# EAGLE schematic Schematic V1 (EAGLE 9.6.2)

## Sheet 1 of 2
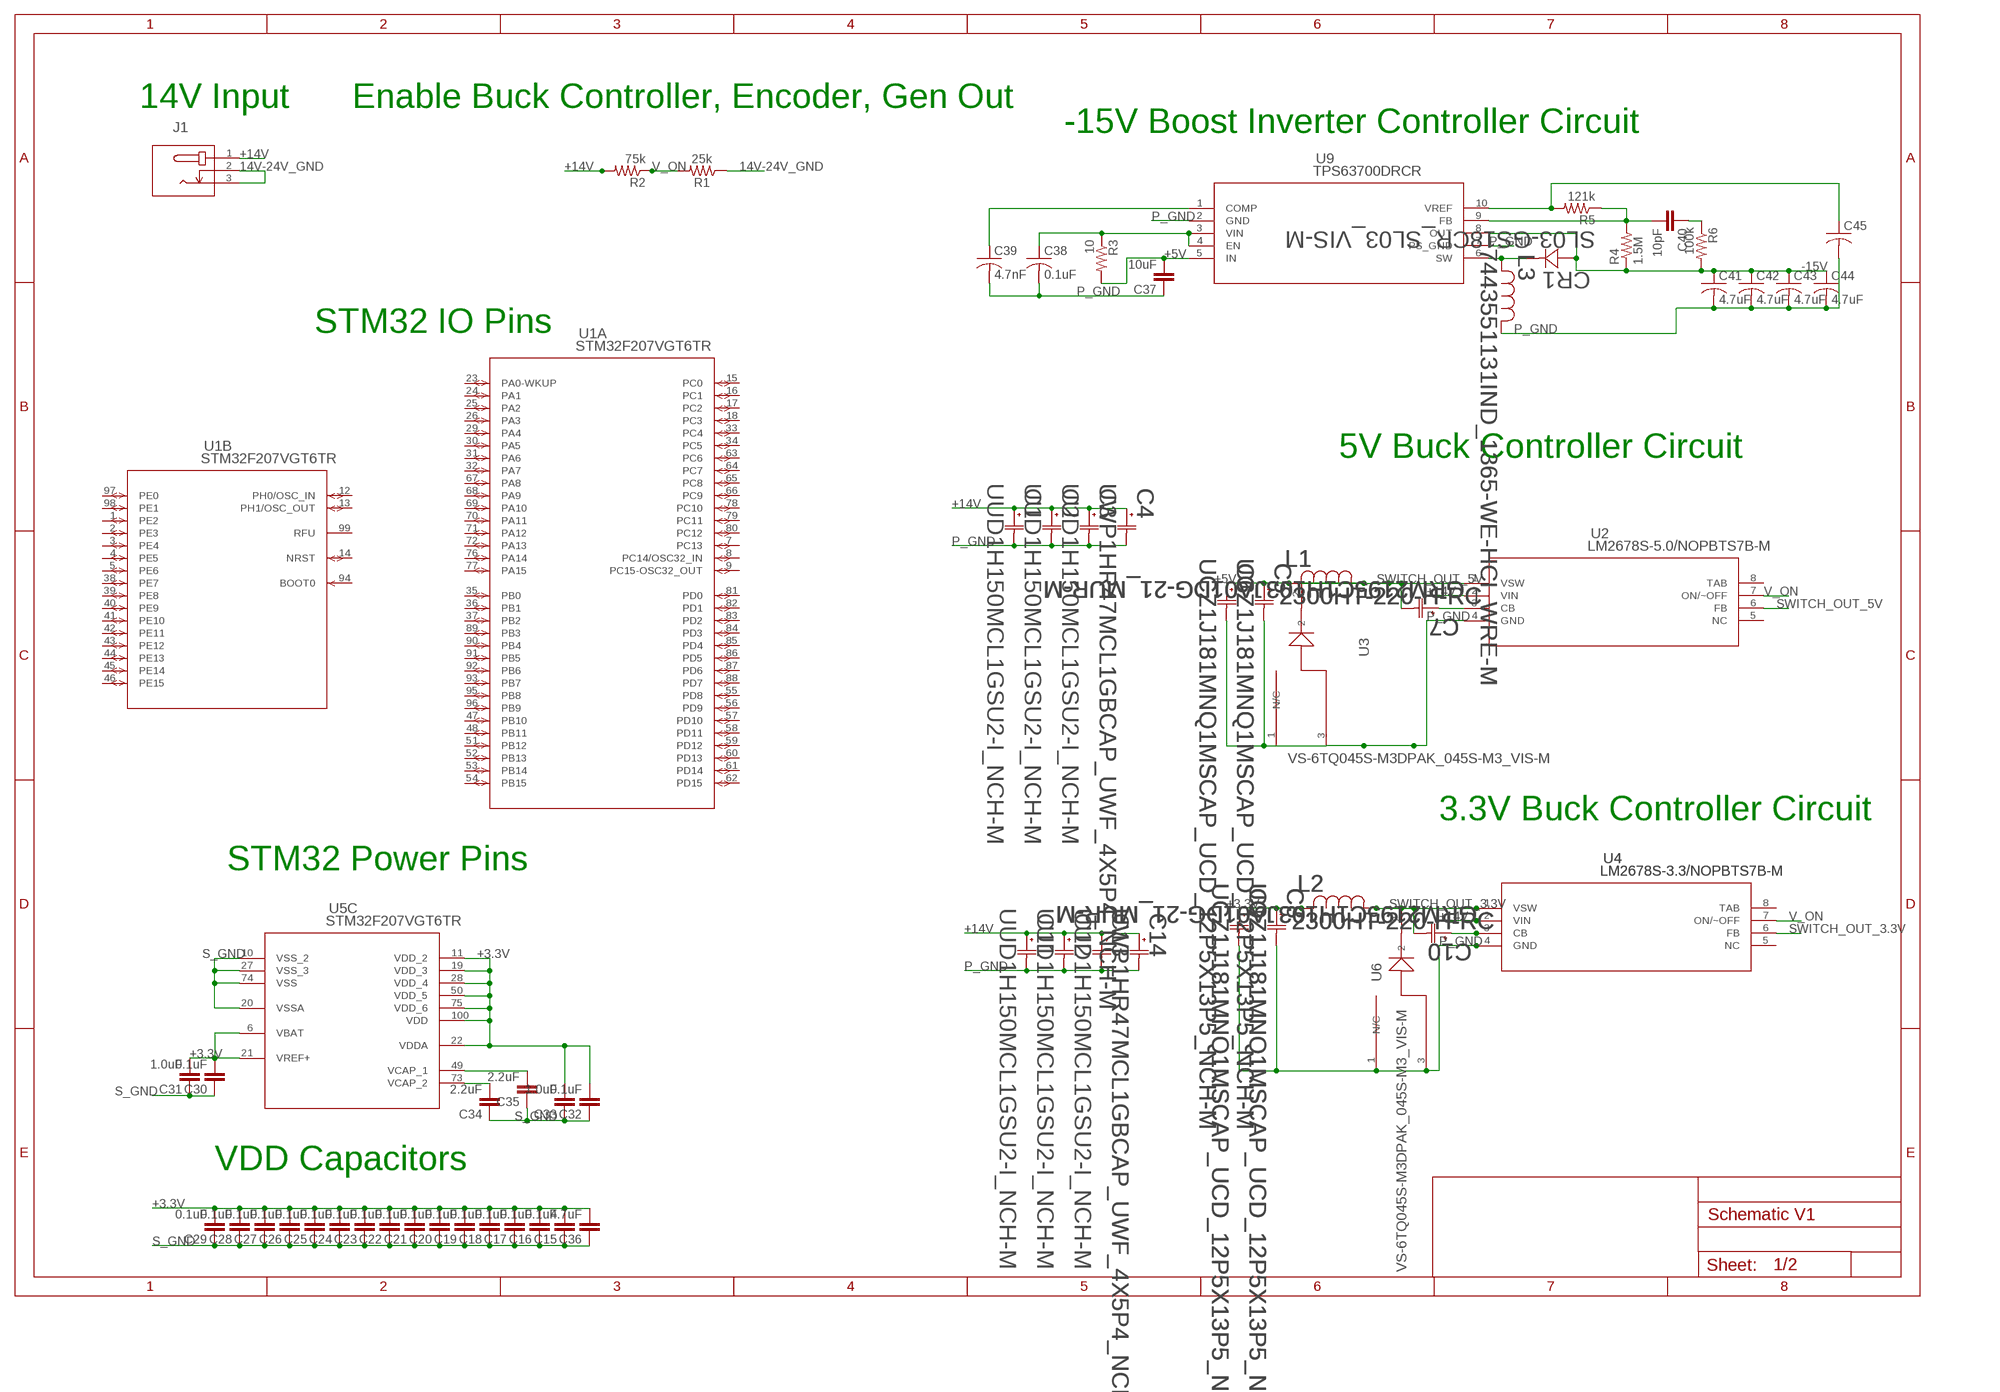
[diagram p0: schematic, sheet 1]

### Parts
C1  UUD1H150MCL1GSU2-I_NCH-M  [U2-I_NCH-M]
C2  UUD1H150MCL1GSU2-I_NCH-M  [U2-I_NCH-M]
C3  UUD1H150MCL1GSU2-I_NCH-M  [U2-I_NCH-M]
C4  UWP1HR47MCL1GBCAP_UWF_4X5P4_NCH-M  [CAP_UWF_4X5P4_NCH-M]
C5  UCZ1J181MNQ1MSCAP_UCD_12P5X13P5_NCH-M  [CAP_UCD_12P5X13P5_NCH-M]
C6  UCZ1J181MNQ1MSCAP_UCD_12P5X13P5_NCH-M  [CAP_UCD_12P5X13P5_NCH-M]
C7  GRM2195C1H103JA01DG-21_MUR-M  [G-21_MUR-M]
C8  UCZ1J181MNQ1MSCAP_UCD_12P5X13P5_NCH-M  [CAP_UCD_12P5X13P5_NCH-M]
C9  UCZ1J181MNQ1MSCAP_UCD_12P5X13P5_NCH-M  [CAP_UCD_12P5X13P5_NCH-M]
C10  GRM2195C1H103JA01DG-21_MUR-M  [G-21_MUR-M]
C11  UUD1H150MCL1GSU2-I_NCH-M  [U2-I_NCH-M]
C12  UUD1H150MCL1GSU2-I_NCH-M  [U2-I_NCH-M]
C13  UUD1H150MCL1GSU2-I_NCH-M  [U2-I_NCH-M]
C14  UWP1HR47MCL1GBCAP_UWF_4X5P4_NCH-M  [CAP_UWF_4X5P4_NCH-M]
C15  0.1uF  1.0UF-0805-25V-10%  [0805]
C16  0.1uF  1.0UF-0805-25V-10%  [0805]
C17  0.1uF  1.0UF-0805-25V-10%  [0805]
C18  0.1uF  1.0UF-0805-25V-10%  [0805]
C19  0.1uF  1.0UF-0805-25V-10%  [0805]
C20  0.1uF  1.0UF-0805-25V-10%  [0805]
C21  0.1uF  1.0UF-0805-25V-10%  [0805]
C22  0.1uF  1.0UF-0805-25V-10%  [0805]
C23  0.1uF  1.0UF-0805-25V-10%  [0805]
C24  0.1uF  1.0UF-0805-25V-10%  [0805]
C25  0.1uF  1.0UF-0805-25V-10%  [0805]
C26  0.1uF  1.0UF-0805-25V-10%  [0805]
C27  0.1uF  1.0UF-0805-25V-10%  [0805]
C28  0.1uF  1.0UF-0805-25V-10%  [0805]
C29  0.1uF  1.0UF-0805-25V-10%  [0805]
C30  0.1uF  1.0UF-0805-25V-10%  [0805]
C31  1.0uF  1.0UF-0805-25V-10%  [0805]
C32  0.1uF  1.0UF-0805-25V-10%  [0805]
C33  1.0uF  1.0UF-0805-25V-10%  [0805]
C34  2.2uF  2.2UF-0805-25V-(+80/-20%)  [0805]
C35  2.2uF  2.2UF-0805-25V-(+80/-20%)  [0805]
C36  4.7uF  2.2UF-0805-25V-(+80/-20%)  [0805]
C37  10uF  10UF-0805-10V-10%  [0805]
C38  0.1uF  C-USC0805  [C0805]
C39  4.7nF  C-USC0805  [C0805]
C40  10pF  10UF-0805-10V-10%  [0805]
C41  4.7uF  C-USC0805  [C0805]
C42  4.7uF  C-USC0805  [C0805]
C43  4.7uF  C-USC0805  [C0805]
C44  4.7uF  C-USC0805  [C0805]
C45  C-USC0805  [C0805]
CR1  SL03-GS18CR_SL03_VIS-M  [CR_SL03_VIS-M]
J1  PJ-202AH  [CONN3_PJ-202_CUD]
L1  2300HT-220-H-RC  [IND_2300HT-H_118_66]
L2  2300HT-220-H-RC  [IND_2300HT-H_118_66]
L3  7443551131IND_1365-WE-HCI_WRE-M  [IND_1365-WE-HCI_WRE-M]
R1  25k  33KOHM-0603-1/10W-1%  [0603]
R2  75k  R-US_R0805  [R0805]
R3  10  R-US_R0805  [R0805]
R4  1.5M  R-US_R0805  [R0805]
R5  121k  R-US_R0805  [R0805]
R6  100k  R-US_R0805  [R0805]
U1  STM32F207VGT6TR  [LQFP100-14X14MM]
U2  LM2678S-5.0/NOPBTS7B-M  [TS7B-M]
U3  VS-6TQ045S-M3DPAK_045S-M3_VIS-M  [DPAK_045S-M3_VIS-M]
U4  LM2678S-3.3/NOPBTS7B-M  [TS7B-M]
U5  STM32F207VGT6TR  [LQFP100-14X14MM]
U6  VS-6TQ045S-M3DPAK_045S-M3_VIS-M  [DPAK_045S-M3_VIS-M]
U9  TPS63700DRCR  [DRC10_2P4X1P65]

### Nets
14V-24V_GND: J1.2 J1.3 R1.1 ; also sheet 2
+3.3V: C8.1 C9.1 C15.2 C16.2 C17.2 C18.2 C19.2 C20.2 C21.2 C22.2 C23.2 C24.2 C25.2 C26.2 C27.2 C28.2 C29.2 C30.2 C31.2 C32.2 C33.2 C36.2 L2.2 U5.6(C:VBAT) U5.11(C:VDD_2) U5.19(C:VDD_3) U5.21(C:VREF+) U5.22(C:VDDA) U5.28(C:VDD_4) U5.50(C:VDD_5) U5.75(C:VDD_6) U5.100(C:VDD)
+5V: C5.1 C6.1 C37.2 L1.2 R3.2 U9.5(IN) ; also sheet 2
+14V: C1.1 C2.1 C3.1 C4.1 C11.1 C12.1 C13.1 C14.1 J1.1 R2.2 U2.2(VIN) U4.2(VIN) ; also sheet 2
-15V: C41.1 C42.1 C43.1 C44.1 CR1.2 R4.1 R6.2 U9.8(OUT) ; also sheet 2
N$1: C10.1 U4.3(CB)
N$2: C7.1 U2.3(CB)
N$3: C39.1 U9.1(COMP)
N$4: C35.2 U5.49(C:VCAP_1)
N$5: C34.2 U5.73(C:VCAP_2)
N$6: C38.1 R3.1 U9.3(VIN) U9.4(EN)
N$7: CR1.1 L3.2 U9.6(SW)
N$9: C45.1 R5.2 U9.10(VREF)
N$10: C40.2 R4.2 R5.1 U9.9(FB)
N$11: C40.1 R6.1
P_GND: C1.2 C2.2 C3.2 C4.2 C5.2 C6.2 C8.2 C9.2 C11.2 C12.2 C13.2 C14.2 C37.1 C38.2 C39.2 C41.2 C42.2 C43.2 C44.2 C45.2 L3.1 U2.4(GND) U3.1(N/C) U3.3(ANODE) U4.4(GND) U6.1(N/C) U6.3(ANODE) U9.2(GND) U9.7(PS_GND) ; also sheet 2
S_GND: C15.1 C16.1 C17.1 C18.1 C19.1 C20.1 C21.1 C22.1 C23.1 C24.1 C25.1 C26.1 C27.1 C28.1 C29.1 C30.1 C31.1 C32.1 C33.1 C34.1 C35.1 C36.1 U5.10(C:VSS_2) U5.20(C:VSSA) U5.27(C:VSS_3) U5.74(C:VSS) ; also sheet 2
SWITCH_OUT_3.3V: C10.2 L2.1 U4.1(VSW) U4.6(FB) U6.2
SWITCH_OUT_5V: C7.2 L1.1 U2.1(VSW) U2.6(FB) U3.2
V_ON: R1.2 R2.1 U2.7(ON/~OFF) U4.7(ON/~OFF) ; also sheet 2
Unconnected: U1.1(B:PE2) U1.2(B:PE3) U1.3(B:PE4) U1.4(B:PE5) U1.5(B:PE6) U1.7(A:PC13) U1.8(A:PC14/OSC32_IN) U1.9(A:PC15-OSC32_OUT) U1.12(B:PH0/OSC_IN) U1.13(B:PH1/OSC_OUT) U1.14(B:NRST) U1.15(A:PC0) U1.16(A:PC1) U1.17(A:PC2) U1.18(A:PC3) U1.23(A:PA0-WKUP) U1.24(A:PA1) U1.25(A:PA2) U1.26(A:PA3) U1.29(A:PA4) U1.30(A:PA5) U1.31(A:PA6) U1.32(A:PA7) U1.33(A:PC4) U1.34(A:PC5) U1.35(A:PB0) U1.36(A:PB1) U1.37(A:PB2) U1.38(B:PE7) U1.39(B:PE8) U1.40(B:PE9) U1.41(B:PE10) U1.42(B:PE11) U1.43(B:PE12) U1.44(B:PE13) U1.45(B:PE14) U1.46(B:PE15) U1.47(A:PB10) U1.48(A:PB11) U1.51(A:PB12) U1.52(A:PB13) U1.53(A:PB14) U1.54(A:PB15) U1.55(A:PD8) U1.56(A:PD9) U1.57(A:PD10) U1.58(A:PD11) U1.59(A:PD12) U1.60(A:PD13) U1.61(A:PD14) U1.62(A:PD15) U1.63(A:PC6) U1.64(A:PC7) U1.65(A:PC8) U1.66(A:PC9) U1.67(A:PA8) U1.68(A:PA9) U1.69(A:PA10) U1.70(A:PA11) U1.71(A:PA12) U1.72(A:PA13) U1.76(A:PA14) U1.77(A:PA15) U1.78(A:PC10) U1.79(A:PC11) U1.80(A:PC12) U1.81(A:PD0) U1.82(A:PD1) U1.83(A:PD2) U1.84(A:PD3) U1.85(A:PD4) U1.86(A:PD5) U1.87(A:PD6) U1.88(A:PD7) U1.89(A:PB3) U1.90(A:PB4) U1.91(A:PB5) U1.92(A:PB6) U1.93(A:PB7) U1.94(B:BOOT0) U1.95(A:PB8) U1.96(A:PB9) U1.97(B:PE0) U1.98(B:PE1) U1.99(B:RFU) U2.5(NC) U2.8(TAB) U4.5(NC) U4.8(TAB) U5.1(B:PE2) U5.2(B:PE3) U5.3(B:PE4) U5.4(B:PE5) U5.5(B:PE6) U5.7(A:PC13) U5.8(A:PC14/OSC32_IN) U5.9(A:PC15-OSC32_OUT) U5.12(B:PH0/OSC_IN) U5.13(B:PH1/OSC_OUT) U5.14(B:NRST) U5.15(A:PC0) U5.16(A:PC1) U5.17(A:PC2) U5.18(A:PC3) U5.23(A:PA0-WKUP) U5.24(A:PA1) U5.25(A:PA2) U5.26(A:PA3) U5.29(A:PA4) U5.30(A:PA5) U5.31(A:PA6) U5.32(A:PA7) U5.33(A:PC4) U5.34(A:PC5) U5.35(A:PB0) U5.36(A:PB1) U5.37(A:PB2) U5.38(B:PE7) U5.39(B:PE8) U5.40(B:PE9) U5.41(B:PE10) U5.42(B:PE11) U5.43(B:PE12) U5.44(B:PE13) U5.45(B:PE14) U5.46(B:PE15) U5.47(A:PB10) U5.48(A:PB11) U5.51(A:PB12) U5.52(A:PB13) U5.53(A:PB14) U5.54(A:PB15) U5.55(A:PD8) U5.56(A:PD9) U5.57(A:PD10) U5.58(A:PD11) U5.59(A:PD12) U5.60(A:PD13) U5.61(A:PD14) U5.62(A:PD15) U5.63(A:PC6) U5.64(A:PC7) U5.65(A:PC8) U5.66(A:PC9) U5.67(A:PA8) U5.68(A:PA9) U5.69(A:PA10) U5.70(A:PA11) U5.71(A:PA12) U5.72(A:PA13) U5.76(A:PA14) U5.77(A:PA15) U5.78(A:PC10) U5.79(A:PC11) U5.80(A:PC12) U5.81(A:PD0) U5.82(A:PD1) U5.83(A:PD2) U5.84(A:PD3) U5.85(A:PD4) U5.86(A:PD5) U5.87(A:PD6) U5.88(A:PD7) U5.89(A:PB3) U5.90(A:PB4) U5.91(A:PB5) U5.92(A:PB6) U5.93(A:PB7) U5.94(B:BOOT0) U5.95(A:PB8) U5.96(A:PB9) U5.97(B:PE0) U5.98(B:PE1) U5.99(B:RFU)

### Notes on the sheet
- 14V Input | Enable Buck Controller, Encoder, Gen Out
- -15V Boost Inverter Controller Circuit
- STM32 IO Pins
- 5V Buck Controller Circuit
- 3.3V Buck Controller Circuit
- STM32 Power Pins
- VDD Capacitors

## Sheet 2 of 2
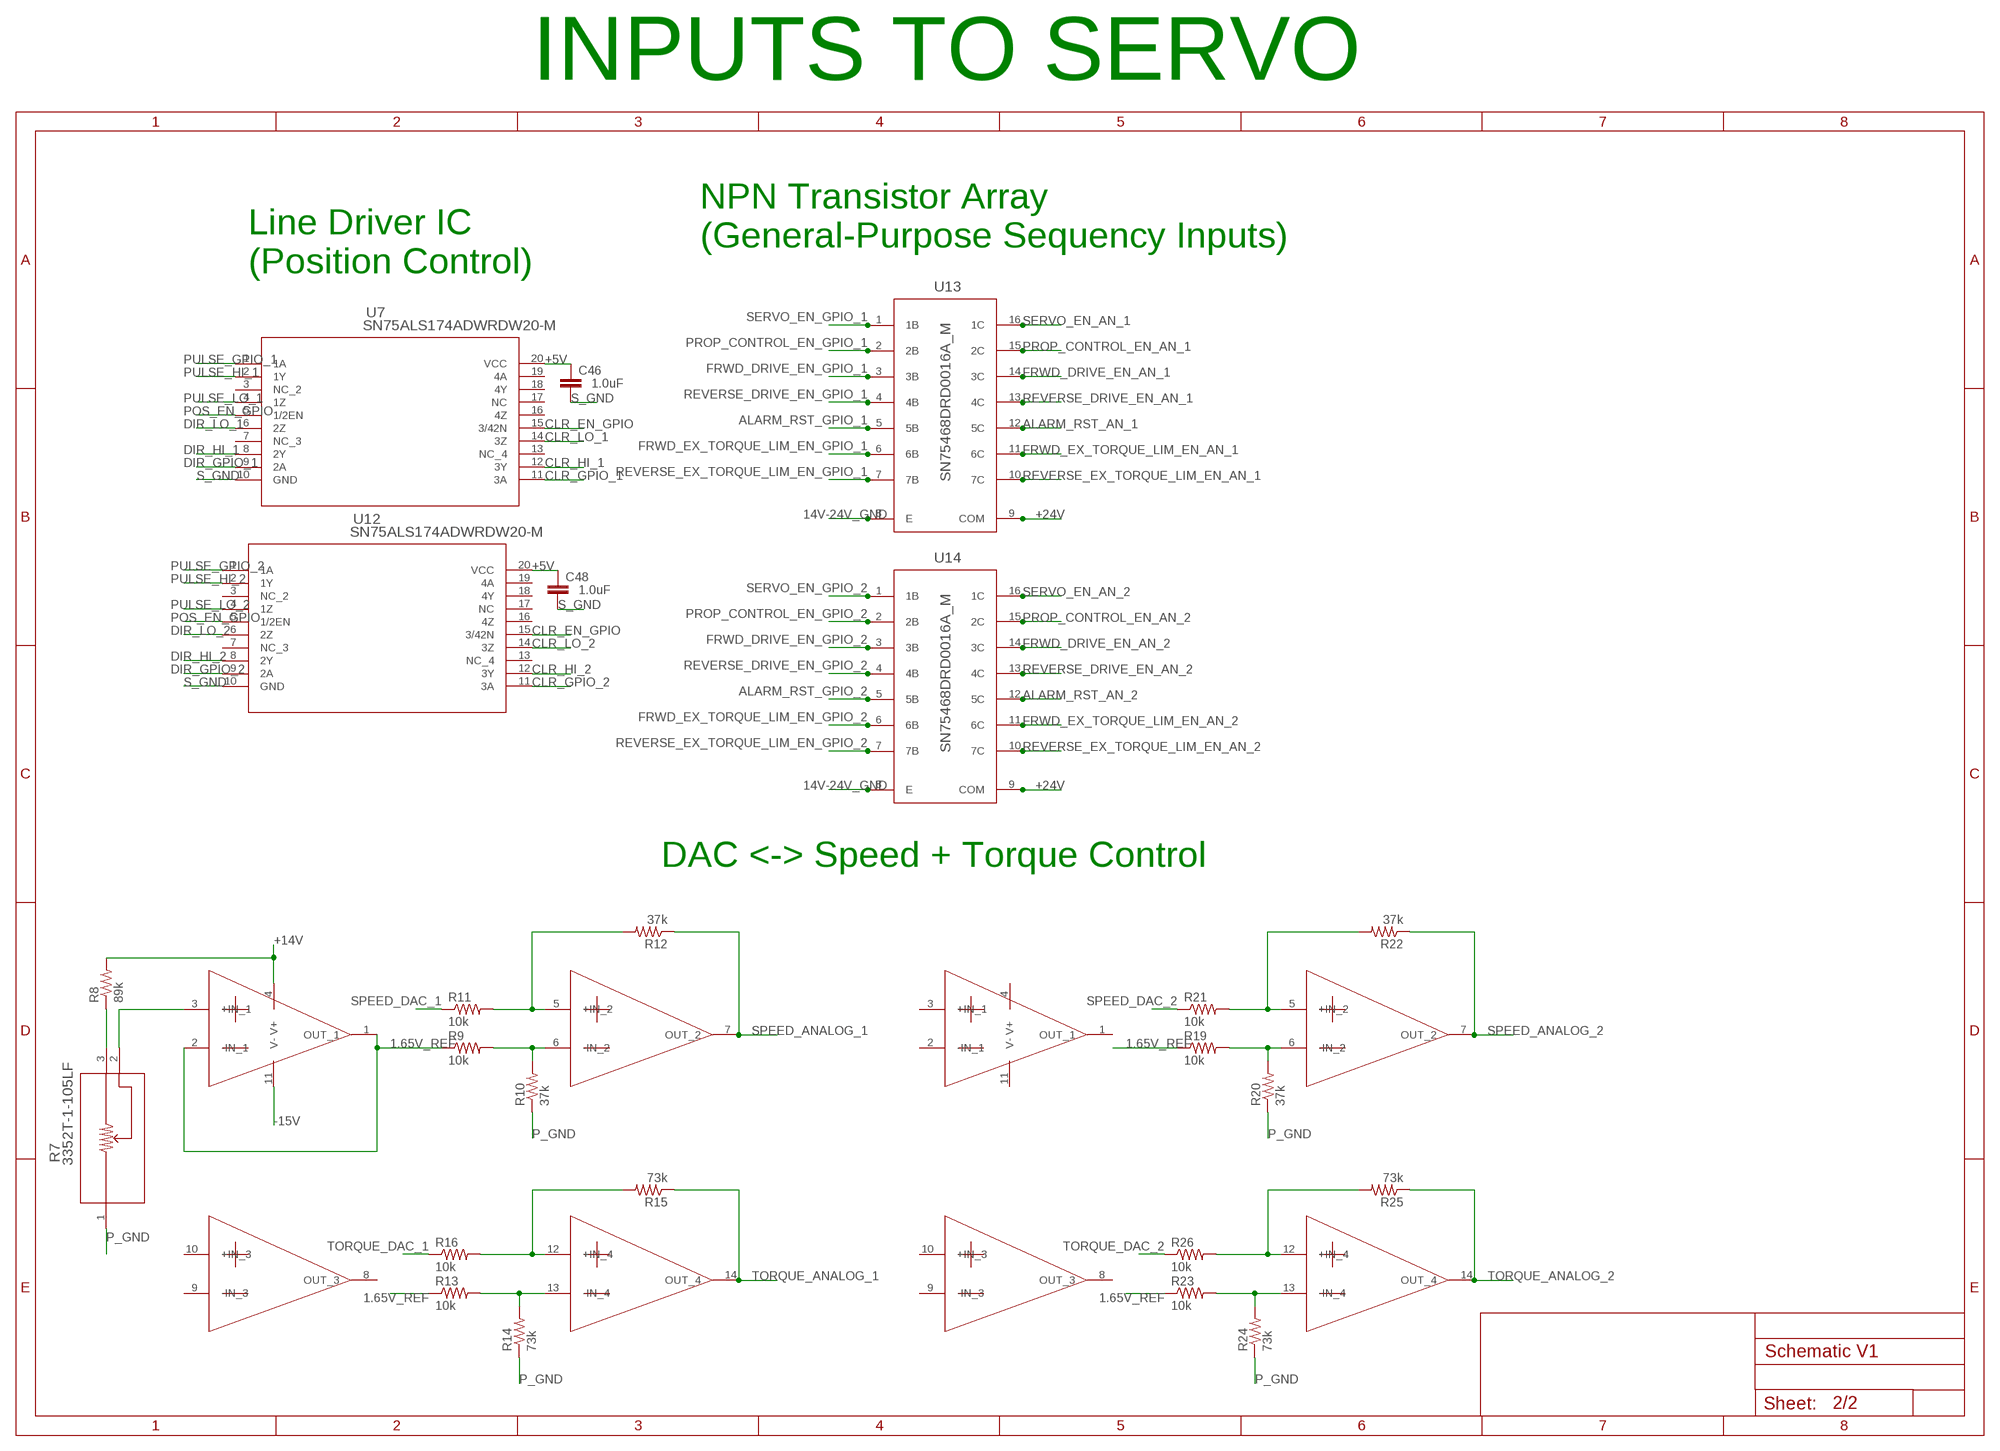
[diagram p1: schematic, sheet 2, part 1 of 2]
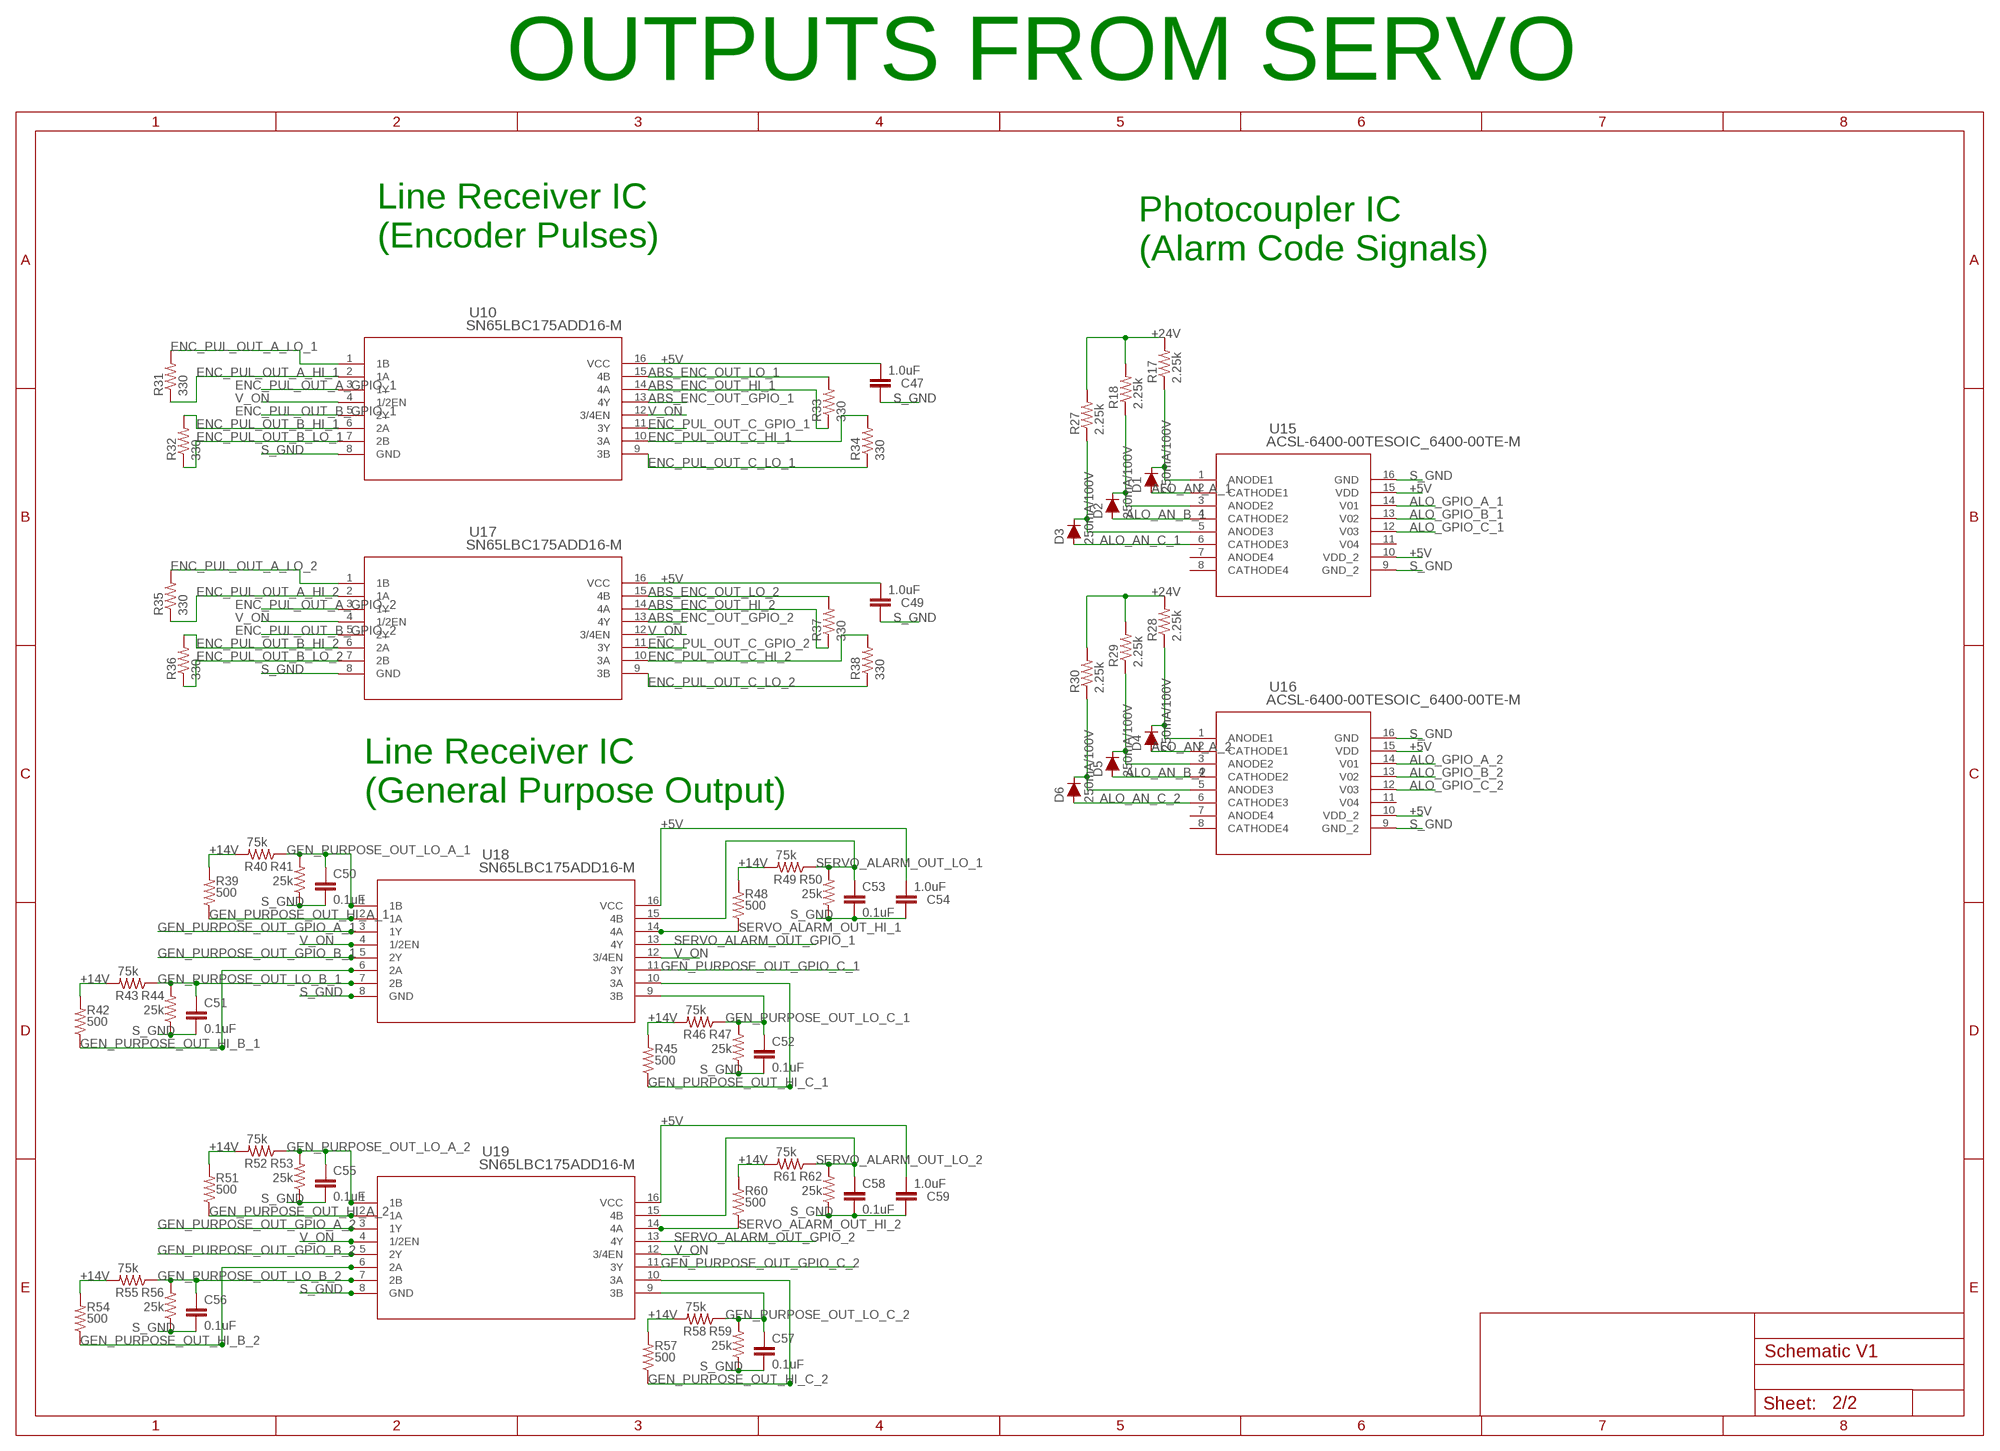
[diagram p2: schematic, sheet 2, part 2 of 2]

### Parts
C46  1.0uF  1.0UF-0805-25V-10%  [0805]
C47  1.0uF  1.0UF-0805-25V-10%  [0805]
C48  1.0uF  1.0UF-0805-25V-10%  [0805]
C49  1.0uF  1.0UF-0805-25V-10%  [0805]
C50  0.1uF  1.0UF-0805-25V-10%  [0805]
C51  0.1uF  1.0UF-0805-25V-10%  [0805]
C52  0.1uF  1.0UF-0805-25V-10%  [0805]
C53  0.1uF  1.0UF-0805-25V-10%  [0805]
C54  1.0uF  1.0UF-0805-25V-10%  [0805]
C55  0.1uF  1.0UF-0805-25V-10%  [0805]
C56  0.1uF  1.0UF-0805-25V-10%  [0805]
C57  0.1uF  1.0UF-0805-25V-10%  [0805]
C58  0.1uF  1.0UF-0805-25V-10%  [0805]
C59  1.0uF  1.0UF-0805-25V-10%  [0805]
D1  250mA/100V  DIODE-BAS16J  [SOD-323]
D2  250mA/100V  DIODE-BAS16J  [SOD-323]
D3  250mA/100V  DIODE-BAS16J  [SOD-323]
D4  250mA/100V  DIODE-BAS16J  [SOD-323]
D5  250mA/100V  DIODE-BAS16J  [SOD-323]
D6  250mA/100V  DIODE-BAS16J  [SOD-323]
R7  3352T-1-105LF  [3352T_BRN]
R8  89k  R-US_R0805  [R0805]
R9  10k  R-US_R0805  [R0805]
R10  37k  R-US_R0805  [R0805]
R11  10k  R-US_R0805  [R0805]
R12  37k  R-US_R0805  [R0805]
R13  10k  R-US_R0805  [R0805]
R14  73k  R-US_R0805  [R0805]
R15  73k  R-US_R0805  [R0805]
R16  10k  R-US_R0805  [R0805]
R17  2.25k  R-US_R0805  [R0805]
R18  2.25k  R-US_R0805  [R0805]
R19  10k  R-US_R0805  [R0805]
R20  37k  R-US_R0805  [R0805]
R21  10k  R-US_R0805  [R0805]
R22  37k  R-US_R0805  [R0805]
R23  10k  R-US_R0805  [R0805]
R24  73k  R-US_R0805  [R0805]
R25  73k  R-US_R0805  [R0805]
R26  10k  R-US_R0805  [R0805]
R27  2.25k  R-US_R0805  [R0805]
R28  2.25k  R-US_R0805  [R0805]
R29  2.25k  R-US_R0805  [R0805]
R30  2.25k  R-US_R0805  [R0805]
R31  330  R-US_R0805  [R0805]
R32  330  R-US_R0805  [R0805]
R33  330  R-US_R0805  [R0805]
R34  330  R-US_R0805  [R0805]
R35  330  R-US_R0805  [R0805]
R36  330  R-US_R0805  [R0805]
R37  330  R-US_R0805  [R0805]
R38  330  R-US_R0805  [R0805]
R39  500  R-US_R0805  [R0805]
R40  75k  R-US_R0805  [R0805]
R41  25k  R-US_R0805  [R0805]
R42  500  R-US_R0805  [R0805]
R43  75k  R-US_R0805  [R0805]
R44  25k  R-US_R0805  [R0805]
R45  500  R-US_R0805  [R0805]
R46  75k  R-US_R0805  [R0805]
R47  25k  R-US_R0805  [R0805]
R48  500  R-US_R0805  [R0805]
R49  75k  R-US_R0805  [R0805]
R50  25k  R-US_R0805  [R0805]
R51  500  R-US_R0805  [R0805]
R52  75k  R-US_R0805  [R0805]
R53  25k  R-US_R0805  [R0805]
R54  500  R-US_R0805  [R0805]
R55  75k  R-US_R0805  [R0805]
R56  25k  R-US_R0805  [R0805]
R57  500  R-US_R0805  [R0805]
R58  75k  R-US_R0805  [R0805]
R59  25k  R-US_R0805  [R0805]
R60  500  R-US_R0805  [R0805]
R61  75k  R-US_R0805  [R0805]
R62  25k  R-US_R0805  [R0805]
U7  SN75ALS174ADWRDW20-M  [DW20-M]
U8  OPA4205APWRTSSOP14_PW_R-PDSO-G14_TEX-M  [TSSOP14_PW_R-PDSO-G14_TEX-M]
U10  SN65LBC175ADD16-M  [D16-M]
U11  OPA4205APWRTSSOP14_PW_R-PDSO-G14_TEX-M  [TSSOP14_PW_R-PDSO-G14_TEX-M]
U12  SN75ALS174ADWRDW20-M  [DW20-M]
U13  SN75468DRD0016A_M  [D0016A_M]
U14  SN75468DRD0016A_M  [D0016A_M]
U15  ACSL-6400-00TESOIC_6400-00TE-M  [SOIC_6400-00TE-M]
U16  ACSL-6400-00TESOIC_6400-00TE-M  [SOIC_6400-00TE-M]
U17  SN65LBC175ADD16-M  [D16-M]
U18  SN65LBC175ADD16-M  [D16-M]
U19  SN65LBC175ADD16-M  [D16-M]

### Nets
1.65V_REF: R9.1 R13.1 R19.1 R23.1 U8.1(OUT_1) U8.2(-IN_1)
14V-24V_GND: U13.8(E) U14.8(E) ; also sheet 1
+5V: C46.2 C47.2 C48.2 C49.2 C54.2 C59.2 U7.20(VCC) U10.16(VCC) U12.20(VCC) U15.10(VDD_2) U15.15(VDD) U16.10(VDD_2) U16.15(VDD) U17.16(VCC) U18.16(VCC) U19.16(VCC) ; also sheet 1
+14V: R8.2 R39.2 R40.2 R42.2 R43.2 R45.2 R46.2 R48.2 R49.2 R51.2 R52.2 R54.2 R55.2 R57.2 R58.2 R60.2 R61.2 U8.4(V+) ; also sheet 1
+24V: R17.2 R18.2 R27.2 R28.2 R29.2 R30.2 U13.9(COM) U14.9(COM)
-15V: U8.11(V-) ; also sheet 1
ABS_ENC_OUT_GPIO_1: U10.13(4Y)
ABS_ENC_OUT_GPIO_2: U17.13(4Y)
ABS_ENC_OUT_HI_1: R33.1 U10.14(4A)
ABS_ENC_OUT_HI_2: R37.1 U17.14(4A)
ABS_ENC_OUT_LO_1: R33.2 U10.15(4B)
ABS_ENC_OUT_LO_2: R37.2 U17.15(4B)
ALARM_RST_AN_1: U13.12(5C)
ALARM_RST_AN_2: U14.12(5C)
ALARM_RST_GPIO_1: U13.5(5B)
ALARM_RST_GPIO_2: U14.5(5B)
ALO_AN_A_1: D1.A U15.2(CATHODE1)
ALO_AN_A_2: D4.A U16.2(CATHODE1)
ALO_AN_B_1: D2.A U15.4(CATHODE2)
ALO_AN_B_2: D5.A U16.4(CATHODE2)
ALO_AN_C_1: D3.A U15.6(CATHODE3)
ALO_AN_C_2: D6.A U16.6(CATHODE3)
ALO_GPIO_A_1: U15.14(V01)
ALO_GPIO_A_2: U16.14(V01)
ALO_GPIO_B_1: U15.13(V02)
ALO_GPIO_B_2: U16.13(V02)
ALO_GPIO_C_1: U15.12(V03)
ALO_GPIO_C_2: U16.12(V03)
CLR_EN_GPIO: U7.15(3/42N) U12.15(3/42N)
CLR_GPIO_1: U7.11(3A)
CLR_GPIO_2: U12.11(3A)
CLR_HI_1: U7.12(3Y)
CLR_HI_2: U12.12(3Y)
CLR_LO_1: U7.14(3Z)
CLR_LO_2: U12.14(3Z)
DIR_GPIO_1: U7.9(2A)
DIR_GPIO_2: U12.9(2A)
DIR_HI_1: U7.8(2Y)
DIR_HI_2: U12.8(2Y)
DIR_LO_1: U7.6(2Z)
DIR_LO_2: U12.6(2Z)
ENC_PUL_OUT_A_GPIO_1: U10.3(1Y)
ENC_PUL_OUT_A_GPIO_2: U17.3(1Y)
ENC_PUL_OUT_A_HI_1: R31.1 U10.2(1A)
ENC_PUL_OUT_A_HI_2: R35.1 U17.2(1A)
ENC_PUL_OUT_A_LO_1: R31.2 U10.1(1B)
ENC_PUL_OUT_A_LO_2: R35.2 U17.1(1B)
ENC_PUL_OUT_B_GPIO_1: U10.5(2Y)
ENC_PUL_OUT_B_GPIO_2: U17.5(2Y)
ENC_PUL_OUT_B_HI_1: R32.2 U10.6(2A)
ENC_PUL_OUT_B_HI_2: R36.2 U17.6(2A)
ENC_PUL_OUT_B_LO_1: R32.1 U10.7(2B)
ENC_PUL_OUT_B_LO_2: R36.1 U17.7(2B)
ENC_PUL_OUT_C_GPIO_1: U10.11(3Y)
ENC_PUL_OUT_C_GPIO_2: U17.11(3Y)
ENC_PUL_OUT_C_HI_1: R34.2 U10.10(3A)
ENC_PUL_OUT_C_HI_2: R38.2 U17.10(3A)
ENC_PUL_OUT_C_LO_1: R34.1 U10.9(3B)
ENC_PUL_OUT_C_LO_2: R38.1 U17.9(3B)
FRWD_DRIVE_EN_AN_1: U13.14(3C)
FRWD_DRIVE_EN_AN_2: U14.14(3C)
FRWD_DRIVE_EN_GPIO_1: U13.3(3B)
FRWD_DRIVE_EN_GPIO_2: U14.3(3B)
FRWD_EX_TORQUE_LIM_EN_AN_1: U13.11(6C)
FRWD_EX_TORQUE_LIM_EN_AN_2: U14.11(6C)
FRWD_EX_TORQUE_LIM_EN_GPIO_1: U13.6(6B)
FRWD_EX_TORQUE_LIM_EN_GPIO_2: U14.6(6B)
GEN_PURPOSE_OUT_GPIO_A_1: U18.3(1Y)
GEN_PURPOSE_OUT_GPIO_A_2: U19.3(1Y)
GEN_PURPOSE_OUT_GPIO_B_1: U18.5(2Y)
GEN_PURPOSE_OUT_GPIO_B_2: U19.5(2Y)
GEN_PURPOSE_OUT_GPIO_C_1: U18.11(3Y)
GEN_PURPOSE_OUT_GPIO_C_2: U19.11(3Y)
GEN_PURPOSE_OUT_HI_A_1: R39.1 U18.2(1A)
GEN_PURPOSE_OUT_HI_A_2: R51.1 U19.2(1A)
GEN_PURPOSE_OUT_HI_B_1: R42.1 U18.6(2A)
GEN_PURPOSE_OUT_HI_B_2: R54.1 U19.6(2A)
GEN_PURPOSE_OUT_HI_C_1: R45.1 U18.10(3A)
GEN_PURPOSE_OUT_HI_C_2: R57.1 U19.10(3A)
GEN_PURPOSE_OUT_LO_A_1: C50.2 R40.1 R41.2 U18.1(1B)
GEN_PURPOSE_OUT_LO_A_2: C55.2 R52.1 R53.2 U19.1(1B)
GEN_PURPOSE_OUT_LO_B_1: C51.2 R43.1 R44.2 U18.7(2B)
GEN_PURPOSE_OUT_LO_B_2: C56.2 R55.1 R56.2 U19.7(2B)
GEN_PURPOSE_OUT_LO_C_1: C52.2 R46.1 R47.2 U18.9(3B)
GEN_PURPOSE_OUT_LO_C_2: C57.2 R58.1 R59.2 U19.9(3B)
N$8: R9.2 R10.2 U8.6(-IN_2)
N$12: R7.2 U8.3(+IN_1)
N$13: R7.3 R8.1
N$15: R11.2 R12.2 U8.5(+IN_2)
N$17: R13.2 R14.2 U8.13(-IN_4)
N$18: R15.2 R16.2 U8.12(+IN_4)
N$20: D1.C R17.1 U15.1(ANODE1)
N$21: R19.2 R20.2 U11.6(-IN_2)
N$22: R21.2 R22.2 U11.5(+IN_2)
N$23: R23.2 R24.2 U11.13(-IN_4)
N$24: R25.2 R26.2 U11.12(+IN_4)
N$25: D2.C R18.1 U15.3(ANODE2)
N$26: D3.C R27.1 U15.5(ANODE3)
N$27: D4.C R28.1 U16.1(ANODE1)
N$28: D5.C R29.1 U16.3(ANODE2)
N$29: D6.C R30.1 U16.5(ANODE3)
P_GND: R7.1 R10.1 R14.1 R20.1 R24.1 ; also sheet 1
POS_EN_GPIO: U7.5(1/2EN) U12.5(1/2EN)
PROP_CONTROL_EN_AN_1: U13.15(2C)
PROP_CONTROL_EN_AN_2: U14.15(2C)
PROP_CONTROL_EN_GPIO_1: U13.2(2B)
PROP_CONTROL_EN_GPIO_2: U14.2(2B)
PULSE_GPIO_1: U7.1(1A)
PULSE_GPIO_2: U12.1(1A)
PULSE_HI_1: U7.2(1Y)
PULSE_HI_2: U12.2(1Y)
PULSE_LO_1: U7.4(1Z)
PULSE_LO_2: U12.4(1Z)
REVERSE_DRIVE_EN_AN_1: U13.13(4C)
REVERSE_DRIVE_EN_AN_2: U14.13(4C)
REVERSE_DRIVE_EN_GPIO_1: U13.4(4B)
REVERSE_DRIVE_EN_GPIO_2: U14.4(4B)
REVERSE_EX_TORQUE_LIM_EN_AN_1: U13.10(7C)
REVERSE_EX_TORQUE_LIM_EN_AN_2: U14.10(7C)
REVERSE_EX_TORQUE_LIM_EN_GPIO_1: U13.7(7B)
REVERSE_EX_TORQUE_LIM_EN_GPIO_2: U14.7(7B)
S_GND: C46.1 C47.1 C48.1 C49.1 C50.1 C51.1 C52.1 C53.1 C54.1 C55.1 C56.1 C57.1 C58.1 C59.1 R41.1 R44.1 R47.1 R50.1 R53.1 R56.1 R59.1 R62.1 U7.10(GND) U10.8(GND) U12.10(GND) U15.9(GND_2) U15.16(GND) U16.9(GND_2) U16.16(GND) U17.8(GND) U18.8(GND) U19.8(GND) ; also sheet 1
SERVO_ALARM_OUT_GPIO_1: U18.13(4Y)
SERVO_ALARM_OUT_GPIO_2: U19.13(4Y)
SERVO_ALARM_OUT_HI_1: R48.1 U18.14(4A)
SERVO_ALARM_OUT_HI_2: R60.1 U19.14(4A)
SERVO_ALARM_OUT_LO_1: C53.2 R49.1 R50.2 U18.15(4B)
SERVO_ALARM_OUT_LO_2: C58.2 R61.1 R62.2 U19.15(4B)
SERVO_EN_AN_1: U13.16(1C)
SERVO_EN_AN_2: U14.16(1C)
SERVO_EN_GPIO_1: U13.1(1B)
SERVO_EN_GPIO_2: U14.1(1B)
SPEED_ANALOG_1: R12.1 U8.7(OUT_2)
SPEED_ANALOG_2: R22.1 U11.7(OUT_2)
SPEED_DAC_1: R11.1
SPEED_DAC_2: R21.1
TORQUE_ANALOG_1: R15.1 U8.14(OUT_4)
TORQUE_ANALOG_2: R25.1 U11.14(OUT_4)
TORQUE_DAC_1: R16.1
TORQUE_DAC_2: R26.1
V_ON: U10.4(1/2EN) U10.12(3/4EN) U17.4(1/2EN) U17.12(3/4EN) U18.4(1/2EN) U18.12(3/4EN) U19.4(1/2EN) U19.12(3/4EN) ; also sheet 1
Unconnected: U7.3(NC_2) U7.7(NC_3) U7.13(NC_4) U7.16(4Z) U7.17(NC) U7.18(4Y) U7.19(4A) U8.8(OUT_3) U8.9(-IN_3) U8.10(+IN_3) U11.1(OUT_1) U11.2(-IN_1) U11.3(+IN_1) U11.4(V+) U11.8(OUT_3) U11.9(-IN_3) U11.10(+IN_3) U11.11(V-) U12.3(NC_2) U12.7(NC_3) U12.13(NC_4) U12.16(4Z) U12.17(NC) U12.18(4Y) U12.19(4A) U15.7(ANODE4) U15.8(CATHODE4) U15.11(V04) U16.7(ANODE4) U16.8(CATHODE4) U16.11(V04)

### Notes on the sheet
- INPUTS TO SERVO | OUTPUTS FROM SERVO
- NPN Transistor Array
  (General-Purpose Sequency Inputs)
- Line Receiver IC
  (Encoder Pulses)
- Photocoupler IC 
  (Alarm Code Signals)
- Line Driver IC
  (Position Control)
- Line Receiver IC
  (General Purpose Output)
- DAC <-> Speed + Torque Control

## Power pins joined to a net without a drawn wire
VBAT: U1.6(C:VBAT)
VCAP_1: U1.49(C:VCAP_1)
VCAP_2: U1.73(C:VCAP_2)
VDD: U1.100(C:VDD)
VDD_2: U1.11(C:VDD_2)
VDD_3: U1.19(C:VDD_3)
VDD_4: U1.28(C:VDD_4)
VDD_5: U1.50(C:VDD_5)
VDD_6: U1.75(C:VDD_6)
VDDA: U1.22(C:VDDA)
VREF+: U1.21(C:VREF+)
VSS: U1.74(C:VSS)
VSS_2: U1.10(C:VSS_2)
VSS_3: U1.27(C:VSS_3)
VSSA: U1.20(C:VSSA)

## Library data of the parts
C1-C3 C11-C13 = SSW-130-01-G-S:UUD1H150MCL1GS; COPYRIGHT: Copyright (C) 2024 Ultra Librarian. All rights reserved.; MANUFACTURER_PART_NUMBER: UUD1H150MCL1GS; MFR_NAME: Nichicon
C4 C14 = SSW-130-01-G-S:UWP1HR47MCL1GB; COPYRIGHT: Copyright (C) 2024 Ultra Librarian. All rights reserved.; MANUFACTURER_PART_NUMBER: UWP1HR47MCL1GB; MFR_NAME: Nichicon
C5 C6 C8 C9 = SSW-130-01-G-S:UCZ1J181MNQ1MS; COPYRIGHT: Copyright (C) 2024 Ultra Librarian. All rights reserved.; MANUFACTURER_PART_NUMBER: UCZ1J181MNQ1MS; MFR_NAME: Nichicon
C7 C10 = SSW-130-01-G-S:GRM2195C1H103JA01D; COPYRIGHT: Copyright (C) 2024 Ultra Librarian. All rights reserved.; MANUFACTURER_PART_NUMBER: GRM2195C1H103JA01D; MFR_NAME: Murata
C15-C30 C32 C50-C53 C55-C58 = SparkFun-Capacitors:1.0UF: 1µF ceramic capacitors A capacitor is a passive two-terminal electrical component used to store electrical energy temporarily in an electric field.; PROD_ID: CAP-08064; VALUE: 1.0uF
C31 C33 C46-C49 C54 C59 = SparkFun-Capacitors:1.0UF: 1µF ceramic capacitors A capacitor is a passive two-terminal electrical component used to store electrical energy temporarily in an electric field.; PROD_ID: CAP-08064
C34 C35 = SparkFun-Capacitors:2.2UF: 2.2µF ceramic capacitors A capacitor is a passive two-terminal electrical component used to store electrical energy temporarily in an electric field.; PROD_ID: CAP-11624
C36 = SparkFun-Capacitors:2.2UF: 2.2µF ceramic capacitors A capacitor is a passive two-terminal electrical component used to store electrical energy temporarily in an electric field.; PROD_ID: CAP-11624; VALUE: 2.2uF
C37 = SparkFun-Capacitors:10UF: 10.0µF ceramic capacitors A capacitor is a passive two-terminal electrical component used to store electrical energy temporarily in an electric field.; PROD_ID: CAP-11330
C38 C39 C41-C45 = rcl:C-US: CAPACITOR, American symbol; SPICEPREFIX: C
C40 = SparkFun-Capacitors:10UF: 10.0µF ceramic capacitors A capacitor is a passive two-terminal electrical component used to store electrical energy temporarily in an electric field.; PROD_ID: CAP-11330; VALUE: 10uF
CR1 = SSW-130-01-G-S:SL03-GS18; COPYRIGHT: Copyright (C) 2024 Ultra Librarian. All rights reserved.; MANUFACTURER_PART_NUMBER: SL03-GS18; MFR_NAME: Vishay
D1-D6 = SparkFun-DiscreteSemi:DIODE: Diode These are standard reverse protection diodes and small signal diodes. SparkFun Products: SparkFun SparkPunk Sound Kit <https://www.sparkfun.com/products/11177> SparkFun ESP8266 Thing <https://www.sparkfun.com/products/13231>; PROD_ID: DIO-09646
J1 = SSW-130-01-G-S:PJ-202AH; COPYRIGHT: Copyright (C) 2024 Ultra Librarian. All rights reserved.; MANUFACTURER_PART_NUMBER: PJ-202AH; MFR_NAME: CUI Devices; TYPE: Power Connectors
L1 L2 = SSW-130-01-G-S:2300HT-220-H-RC; COPYRIGHT: Copyright (C) 2024 Ultra Librarian. All rights reserved.; MANUFACTURER_PART_NUMBER: 2300HT-220-H-RC; MFR_NAME: Bourns Electronics
L3 = SSW-130-01-G-S:7443551131; COPYRIGHT: Copyright (C) 2024 Ultra Librarian. All rights reserved.; MANUFACTURER_PART_NUMBER: 7443551131; MFR_NAME: Wurth Electronics
R1 = SparkFun-Resistors:33KOHM: 33kΩ resistor A resistor is a passive two-terminal electrical component that implements electrical resistance as a circuit element. Resistors act to reduce current flow, and, at the same time, act to lower voltage levels within circuits. - Wikipedia; PROD_ID: RES-08416; VALUE: 33k
R2-R6 R8-R62 = rcl:R-US_: RESISTOR, American symbol; SPICEPREFIX: R
R7 = SSW-130-01-G-S:3352T-1-105LF; COPYRIGHT: Copyright (C) 2024 Ultra Librarian. All rights reserved.; MANUFACTURER_PART_NUMBER: 3352T-1-105LF; MFR_NAME: Bourns Electronics
U1 U5 = SSW-130-01-G-S:STM32F207VGT6TR; COPYRIGHT: Copyright (C) 2024 Ultra Librarian. All rights reserved.; MANUFACTURER_PART_NUMBER: STM32F207VGT6TR; MFR_NAME: STMicroelectronics
U2 = SSW-130-01-G-S:LM2678S-5.0/NOPB; COPYRIGHT: Copyright (C) 2024 Ultra Librarian. All rights reserved.; MANUFACTURER_PART_NUMBER: LM2678S-5.0/NOPB; MFR_NAME: Texas Instruments; TYPE: LM2678S-12
U3 U6 = SSW-130-01-G-S:VS-6TQ045S-M3; COPYRIGHT: Copyright (C) 2024 Ultra Librarian. All rights reserved.; MANUFACTURER_PART_NUMBER: VS-6TQ045S-M3; MFR_NAME: Vishay
U4 = SSW-130-01-G-S:LM2678S-3.3/NOPB; COPYRIGHT: Copyright (C) 2024 Ultra Librarian. All rights reserved.; MANUFACTURER_PART_NUMBER: LM2678S-3.3/NOPB; MFR_NAME: Texas Instruments; TYPE: LM2678S-12
U7 U12 = SSW-130-01-G-S:SN75ALS174ADWR; COPYRIGHT: Copyright (C) 2024 Ultra Librarian. All rights reserved.; MANUFACTURER_PART_NUMBER: SN75ALS174ADWR; MFR_NAME: Texas Instruments
U8 U11 = SSW-130-01-G-S:OPA4205APWR; COPYRIGHT: Copyright (C) 2024 Ultra Librarian. All rights reserved.; MANUFACTURER_PART_NUMBER: OPA4205APWR; MFR_NAME: Texas Instruments; TYPE: Linear
U9 = SSW-130-01-G-S:TPS63700DRCR; COPYRIGHT: Copyright (C) 2024 Ultra Librarian. All rights reserved.; MANUFACTURER_PART_NUMBER: TPS63700DRCR; MFR_NAME: Texas Instruments
U10 U17-U19 = SSW-130-01-G-S:SN65LBC175AD; COPYRIGHT: Copyright (C) 2024 Ultra Librarian. All rights reserved.; MANUFACTURER_PART_NUMBER: SN65LBC175AD; MFR_NAME: Texas Instruments
U13 U14 = SSW-130-01-G-S:SN75468DR; COPYRIGHT: Copyright (C) 2024 Ultra Librarian. All rights reserved.; MANUFACTURER_PART_NUMBER: SN75468DR; MFR_NAME: Texas Instruments; REFDES: RefDes; TYPE: TYPE
U15 U16 = SSW-130-01-G-S:ACSL-6400-00TE; COPYRIGHT: Copyright (C) 2024 Ultra Librarian. All rights reserved.; MANUFACTURER_PART_NUMBER: ACSL-6400-00TE; MFR_NAME: Broadcom